# Altium schematic sheet 云台原理图.SchDoc
size A4; SheetNumber: 1; SheetTotal: 1
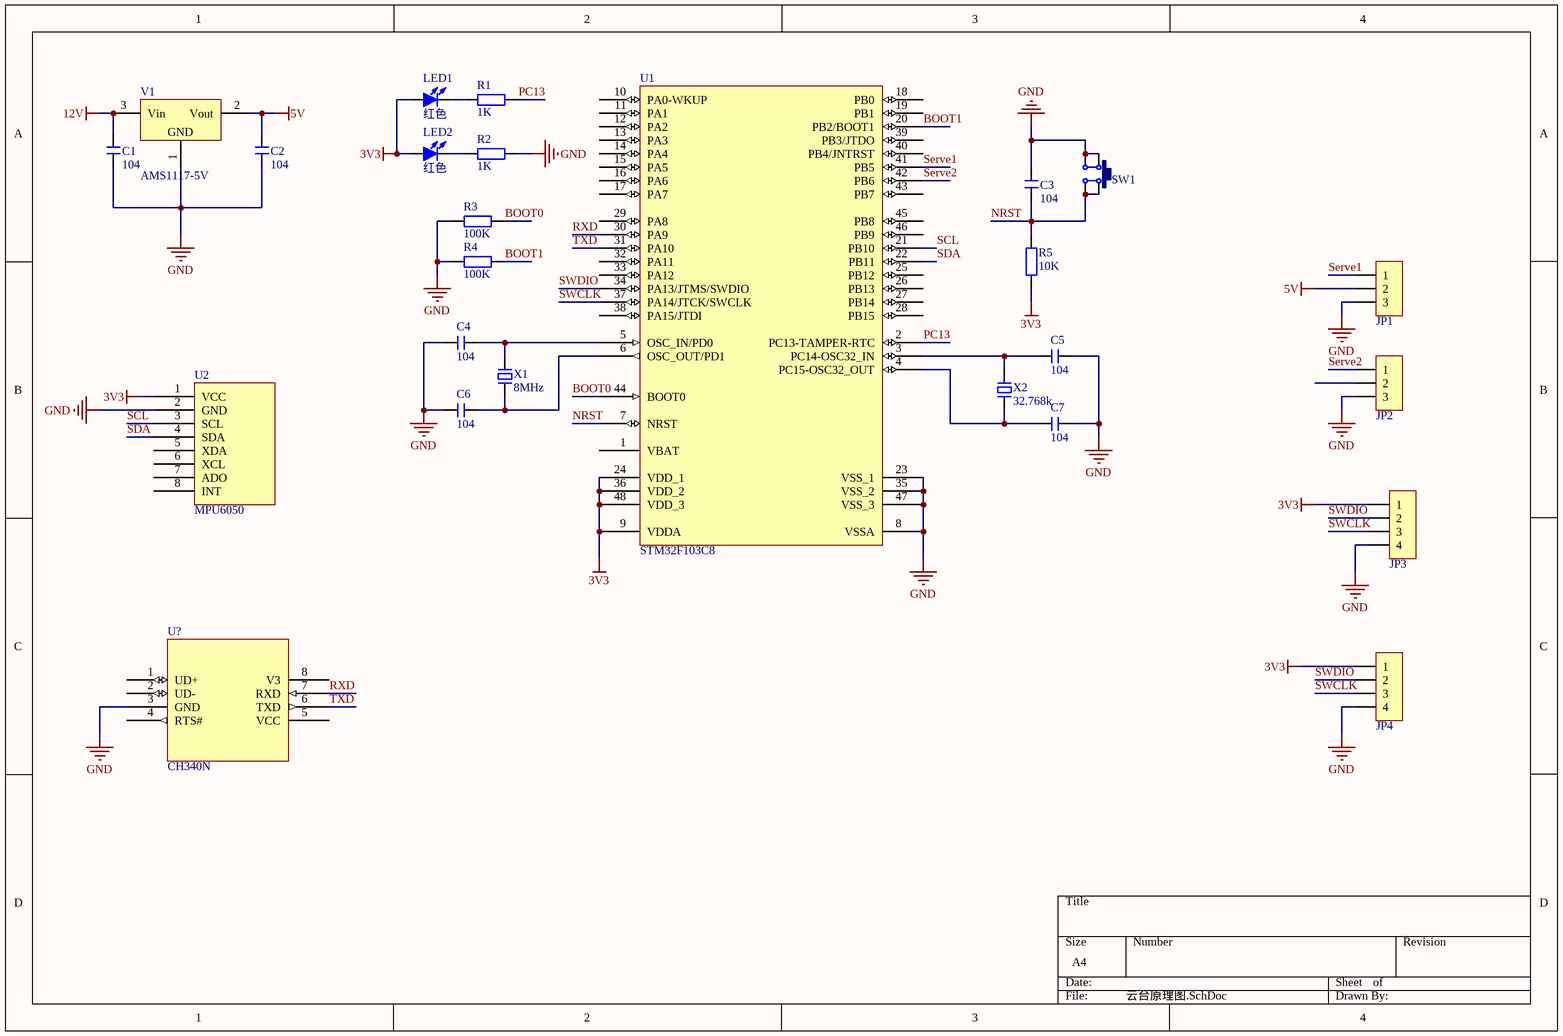
[diagram p0: 云台原理图.SchDoc]

## Parts
C1  104  [C 0603_L]
C2  104  [C 0603_L]
C3  104  [C 0603_L]
C4  104  [C 0603_L]
C5  104  [C 0603_L]
C6  104  [C 0603_L]
C7  104  [C 0603_L]
JP1  HDR-1X3  [HDR2.54-LI-3P]  (value not drawn)
JP2  HDR-1X3  [HDR2.54-LI-3P]  (value not drawn)
JP3  HDR-1X4  [HDR2.54-LI-4P]  (value not drawn)
JP4  HDR-1X4  [HDR2.54-LI-4P]  (value not drawn)
LED1  红色  [LED 0805G]
LED2  红色  [LED 0805G]
R1  1K  [R 0603_L]
R2  1K  [R 0603_L]
R3  100K  [R 0603_L]
R4  100K  [R 0603_L]
R5  10K  [R 0603_L]
SW1  6x6x5  [TSW DIP-6*6*6]  (value not drawn)
U1  STM32F103C8  [LQFP48 7X7_M]
U2  MPU6050
U?  CH340N  [CH340N]
V1  AMS1117-5V  [SOT223_L]
X1  8MHz  [OSC HC-49S]
X2  32.768k  [OSC HC-49S]

## Nets
3V3: JP3.1 JP4.1 LED1.1(A) LED2.1(A) R5.1 U1.9(VDDA) U1.24(VDD_1) U1.36(VDD_2) U1.48(VDD_3) U2.1(VCC)
5V: C2.1 JP1.2 V1.2(Vout)
12V: C1.1 V1.3(Vin)
GND: C1.2 C2.2 C3.2 C4.1 C5.2 C6.1 C7.2 JP1.3 JP2.3 JP3.4 JP4.4 R2.1 R3.1 R4.1 SW1.1 SW1.4 U1.8(VSSA) U1.23(VSS_1) U1.35(VSS_2) U1.47(VSS_3) U2.2(GND) U?.3(GND) V1.1(GND)
BOOT0: R3.2 U1.44(BOOT0)
BOOT1: R4.2 U1.20(PB2/BOOT1)
NRST: C3.1 R5.2 SW1.2 SW1.3 U1.7(NRST)
PC13: R1.1 U1.2(PC13-TAMPER-RTC)
RXD: U1.30(PA9) U?.7(RXD)
SCL: U1.21(PB10) U2.3(SCL)
SDA: U1.22(PB11) U2.4(SDA)
Serve1: JP1.1 U1.41(PB5)
Serve2: JP2.1 U1.42(PB6)
SWCLK: JP3.3 JP4.3 U1.37(PA14/JTCK/SWCLK)
SWDIO: JP3.2 JP4.2 U1.34(PA13/JTMS/SWDIO)
TXD: U1.31(PA10) U?.6(TXD)
NetC4_2: C4.2 U1.5(OSC_IN/PD0) X1.2
NetC5_1: C5.1 U1.3(PC14-OSC32_IN) X2.2
NetC6_2: C6.2 U1.6(OSC_OUT/PD1) X1.1
NetC7_1: C7.1 U1.4(PC15-OSC32_OUT) X2.1
NetLED1_2: LED1.2(K) R1.2
NetLED2_2: LED2.2(K) R2.2

Not connected (* = marked no-connect by the designer): JP2 2; U1 1(VBAT) 10(PA0-WKUP) 11(PA1) 12(PA2) 13(PA3) 14(PA4) 15(PA5) 16(PA6) 17(PA7) 18(PB0) 19(PB1) 25(PB12) 26(PB13) 27(PB14) 28(PB15) 29(PA8) 32(PA11) 33(PA12) 38(PA15/JTDI) 39(PB3/JTDO) 40(PB4/JNTRST) 43(PB7) 45(PB8) 46(PB9); U2 5(XDA) 6(XCL) 7(ADO) 8(INT); U? 1(UD+) 2(UD-) 4(RTS#) 5(VCC) 8(V3)

## Library data of the parts
C1-C7 = C: 无极性贴片电容; 版权归属: 源创客; BOM名称: 无极性贴片电容; 学习资源: www.ooocke.com
JP1 JP2 = Header 3: 3P接插件; 版权归属: 源创客; BOM名称: 3P接插件; 学习资源: www.ooocke.com
JP3 JP4 = Header 4: 4P接插件; 版权归属: 源创客; BOM名称: 4P接插件; 学习资源: www.ooocke.com
LED1 LED2 = LED-SMD: 贴片LED; 版权归属: 源创客; BOM名称: 贴片LED; 学习资源: www.ooocke.com
R1-R5 = R: 贴片电阻; 版权归属: 源创客; BOM名称: 贴片电阻; 学习资源: www.ooocke.com
SW1 = TSW DIP-6x6: 直插6x6轻触开关; 版权归属: 源创客; BOM名称: 直插6x6轻触开关; 学习资源: www.ooocke.com
U1 = STM32F103C8: Flaah:64/RAM:20/IO:36; BOM名称: 32位STM单片机; 版权归属: 源创客; 学习资源: www.ooocke.com
U2 = MPU6050模块: MPU6050_IIC模块
U? = CH340N: CH340N串口转USB
V1 = AMS1117: 三端稳压芯片; BOM名称: 稳压芯片; 版权归属: 源创客; 学习资源: www.ooocke.com
X1 X2 = XTAL-2P: 2脚无源脚晶振; 版权归属: 源创客; BOM名称: 2脚无源脚晶振; 学习资源: www.ooocke.com